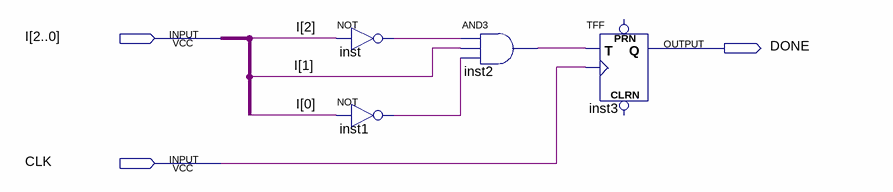
[diagram p0: schematic sheet]
// Quartus schematic DoneCheck.bdf as structural Verilog: 4 symbols, 3 pins
module DoneCheck (
  input  [2:0] I,
  input  CLK,
  output DONE
);

  wire inst1_out, inst2_out, inst_out;

  not inst (inst_out, I[2]);
  not inst1 (inst1_out, I[0]);
  and inst2 (inst2_out, inst_out, I[1], inst1_out);
  TFF inst3 (.T(inst2_out), .CLK(CLK), .Q(DONE));  // open: PRN, CLRN
endmodule
